# EAGLE design papillio-pmod-target (EAGLE 6.5.0)
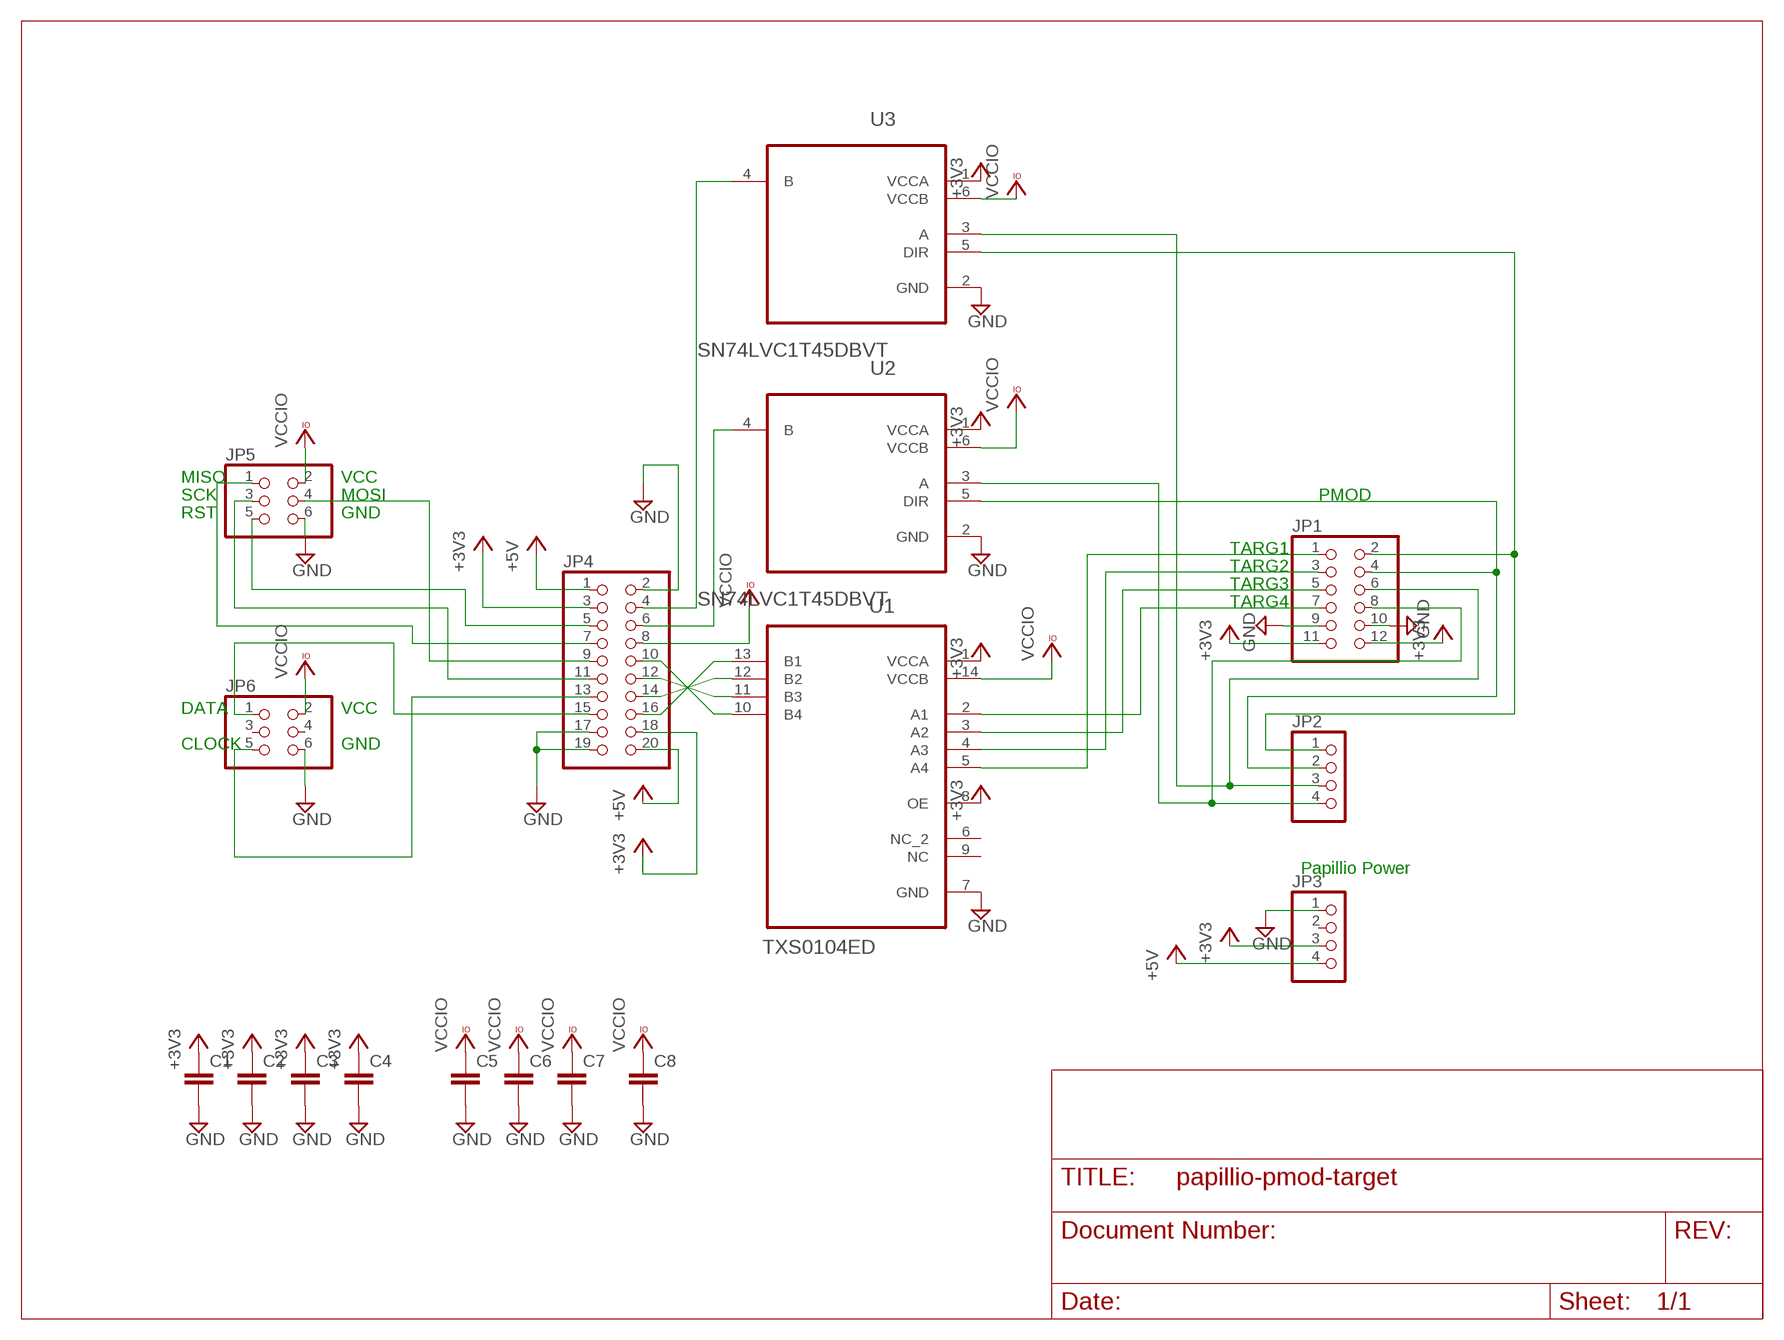
[diagram p0: schematic, sheet 1]

## Parts
C1  C-EUC0603  [C0603]
C2  C-EUC0603  [C0603]
C3  C-EUC0603  [C0603]
C4  C-EUC0603  [C0603]
C5  C-EUC0603  [C0603]
C6  C-EUC0603  [C0603]
C7  C-EUC0603  [C0603]
C8  C-EUC0603  [C0603]
JP1  PINHD-2X6  [2X06]
JP2  PINHD-1X4  [1X04]
JP3  PINHD-1X4  [1X04]
JP4  PINHD-2X10  [2X10]
JP5  PINHD-2X3  [2X03]
JP6  PINHD-2X3  [2X03]
U1  TXS0104ED  [SOIC127P600X175-14N]
U2  SN74LVC1T45DBVT  [SOT95P280X145-6N]
U3  SN74LVC1T45DBVT  [SOT95P280X145-6N]

## Nets
+3V3 [power]: C1.1 C2.1 C3.1 C4.1 JP1.11 JP1.12 JP3.3 JP4.3 JP4.18 U1.1(VCCA) U1.8(OE) U2.1(VCCA) U3.1(VCCA)
+5V [power]: JP3.4 JP4.1 JP4.20
GND [power]: C1.2 C2.2 C3.2 C4.2 C5.2 C6.2 C7.2 C8.2 JP1.9 JP1.10 JP3.1 JP4.2 JP4.17 JP4.19 JP5.6 JP6.6 U1.7(GND) U2.2(GND) U3.2(GND)
N$1: JP1.2 JP2.1
N$2: JP1.4 JP2.2 U2.5(DIR)
N$3: JP1.6 JP2.3 U3.3(A)
N$4: JP1.8 JP2.4 U2.3(A)
N$5: JP4.10 U1.10(B4)
N$6: JP4.16 U1.13(B1)
N$7: JP4.14 U1.12(B2)
N$8: JP4.12 U1.11(B3)
N$9: JP4.4 U3.4(B)
N$10: JP1.1 U1.5(A4)
N$11: JP1.3 U1.4(A3)
N$12: JP1.5 U1.3(A2)
N$13: JP1.7 U1.2(A1)
N$14: JP4.6 U2.4(B)
N$17: JP4.15 JP6.1
N$18: JP4.13 JP6.5
N$19: JP4.5 JP5.5
N$20: JP4.11 JP5.3
N$21: JP4.9 JP5.4
N$22: JP4.7 JP5.1
VCCIO [power]: C5.1 C6.1 C7.1 C8.1 JP4.8 JP5.2 JP6.2 U1.14(VCCB) U2.6(VCCB) U3.6(VCCB)
Unconnected: JP3.2 JP6.3 JP6.4 U1.6(NC_2) U1.9(NC) U3.5(DIR)

## Notes on the sheet
- MISO | VCC
- SCK | MOSI | PMOD
- RST | GND
- TARG1
- TARG2
- TARG3
- TARG4
- DATA | VCC
- CLOCK | GND
- Papillio Power

## Library data of the parts
C1-C8 = resistor:C-EU: CAPACITOR, European symbol
JP1 = pinhead:PINHD-2X6: PIN HEADER
JP2 JP3 = pinhead:PINHD-1X4: PIN HEADER
JP4 = pinhead:PINHD-2X10: PIN HEADER
JP5 JP6 = pinhead:PINHD-2X3: PIN HEADER
U1 = Texas Instruments_By_element14_Batch_1:TXS0104ED: 4-BIT BIDIRECTIONAL VOLTAGE-LEVEL TRANSLATOR FOR OPEN-DRAIN AND PUSH-PULL APPLICATIONS; MPN: TXS0104ED; OC_FARNELL: 1607892; OC_NEWARK: 10M0686; PACKAGE: SOIC-14; SUPPLIER: TEXAS INSTRUMENTS
U2 U3 = Texas Instruments_By_element14_Batch_1:SN74LVC1T45DBVT: BUS Transceiver; MPN: SN74LVC1T45DBVT; OC_FARNELL: 1470916; OC_NEWARK: 01J0796; PACKAGE: SOT-23; SUPPLIER: Texas Instruments

## Net classes
1 power: width 0.381 mm

## Board
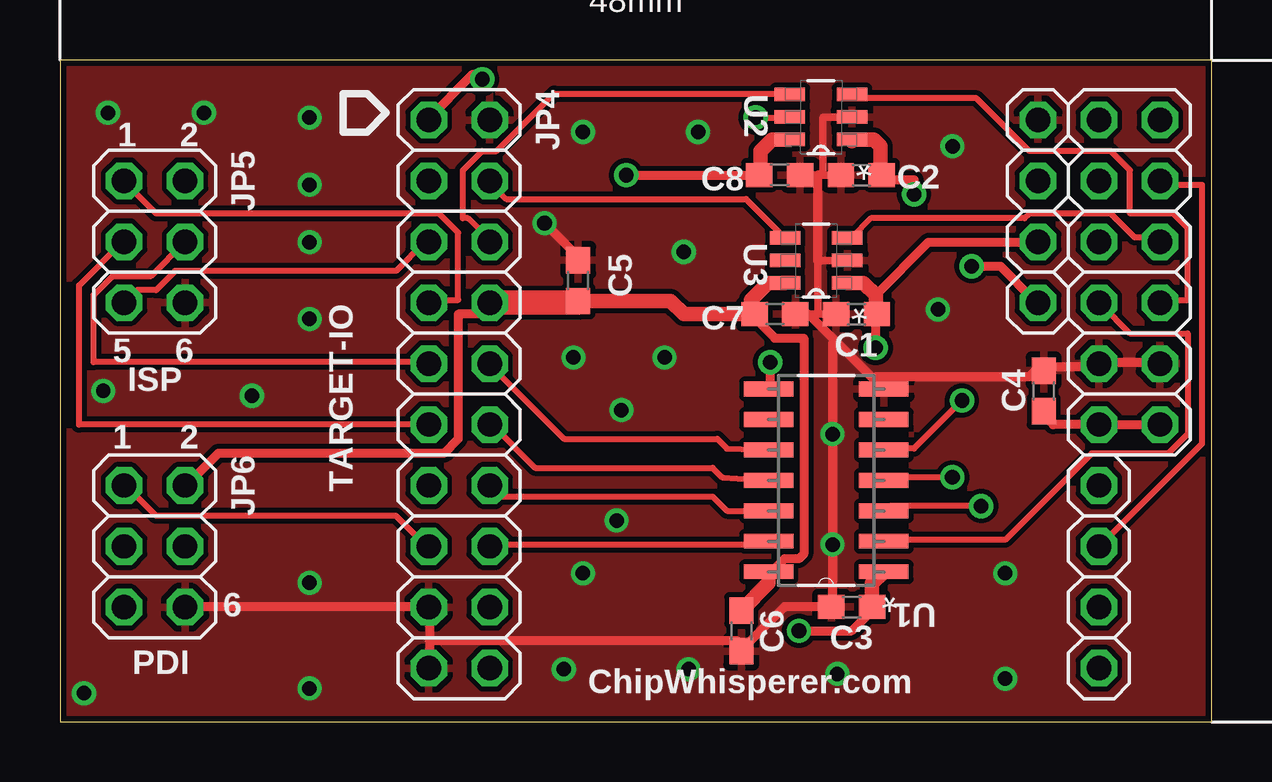
[diagram p1: board, top side]
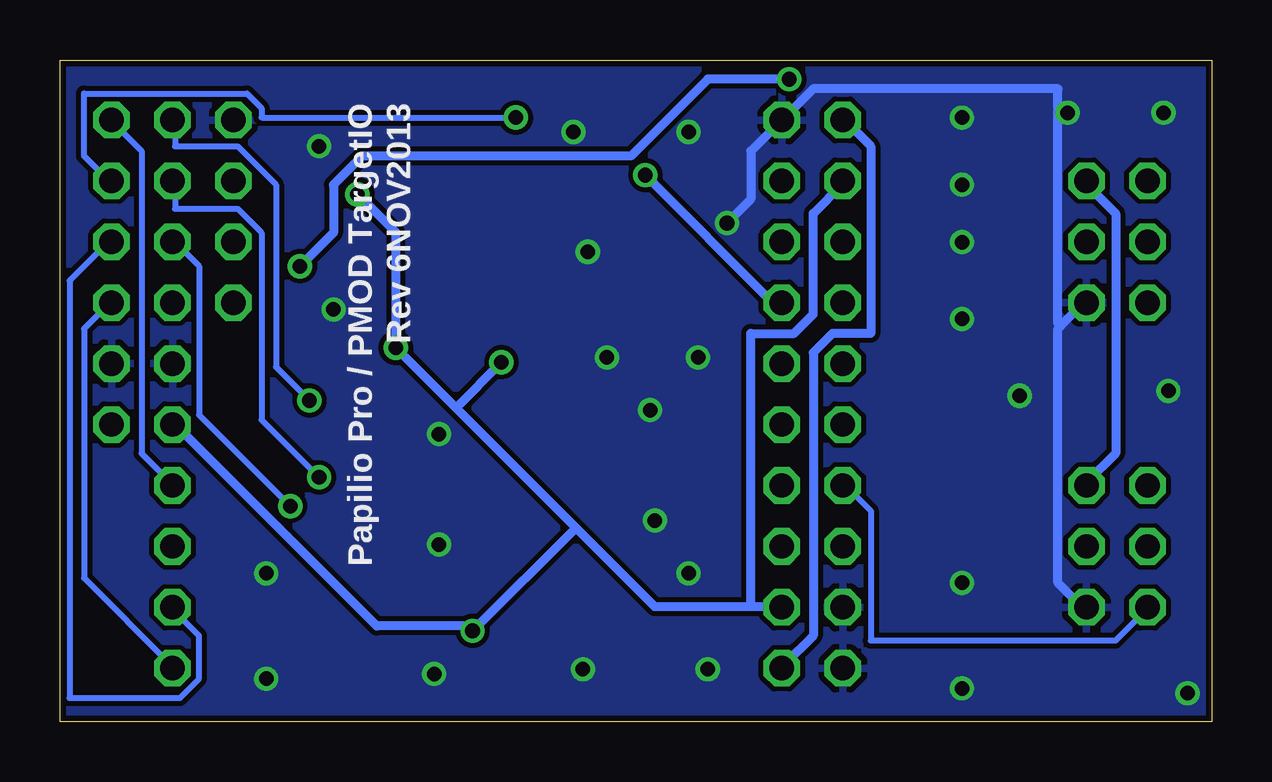
[diagram p2: board, bottom side, seen from below]

Size 48 x 27.6 mm. Coordinates in mm from the lower left corner, seen from the top.
Outline: 0,0 48,0 48,27.6 0,27.6 0,0
Copper layers (1*16): Top 0.035mm / dielectric 1.5mm / Bottom 0.035mm
Design rules "default *": minimum track width 10mil, minimum drill 24mil, track to track 8mil, track to pad 8mil, pad to pad 8mil, via to via 8mil, smd to smd 8mil, copper to edge 10mil, drill to drill 8mil, minimum pad ring 10mil, minimum via ring 8mil, stop-mask expansion 4mil, vias tented up to drill 25mil, thermal gap 10mil

### Footprints (pad centres in the part's own frame; a part is rotated, then mirrored left to right if it is on the bottom)
C0603 = smd 1.1 x 1: 1 -0.85,0; 2 0.85,0
2X06 = drill 1.016 octagon: 1 -6.35,-1.27; 2 -6.35,1.27; 3 -3.81,-1.27; 4 -3.81,1.27; 5 -1.27,-1.27; 6 -1.27,1.27; 7 1.27,-1.27; 8 1.27,1.27; 9 3.81,-1.27; 10 3.81,1.27; 11 6.35,-1.27; 12 6.35,1.27
1X04 = drill 1.016 octagon: 1 -3.81,0; 2 -1.27,0; 3 1.27,0; 4 3.81,0
2X10 = drill 1.016 octagon: 1 -11.43,-1.27; 2 -11.43,1.27; 3 -8.89,-1.27; 4 -8.89,1.27; 5 -6.35,-1.27; 6 -6.35,1.27; 7 -3.81,-1.27; 8 -3.81,1.27; 9 -1.27,-1.27; 10 -1.27,1.27; 11 1.27,-1.27; 12 1.27,1.27; 13 3.81,-1.27; 14 3.81,1.27; 15 6.35,-1.27; 16 6.35,1.27; 17 8.89,-1.27; 18 8.89,1.27; 19 11.43,-1.27; 20 11.43,1.27
2X03 = drill 1.016 octagon: 1 -2.54,-1.27; 2 -2.54,1.27; 3 0,-1.27; 4 0,1.27; 5 2.54,-1.27; 6 2.54,1.27
SOIC127P600X175-14N = smd 2.057 x 0.61: 1 -4.801,7.62; 2 -4.801,6.35; 3 -4.801,5.08; 4 -4.801,3.81; 5 -4.801,2.54; 6 -4.801,1.27; 7 -4.801,0; 8 0,0; 9 0,1.27; 10 0,2.54; 11 0,3.81; 12 0,5.08; 13 0,6.35; 14 0,7.62
SOT95P280X145-6N = smd 1.27 x 0.559: 1 -1.295,0.94; 2 -1.295,0; 3 -1.295,-0.94; 4 1.295,-0.94; 5 1.295,0; 6 1.295,0.94

### Placement (x,y rotation side)
C1  33.2,17 180 top
C2  33.4,22.8 180 top
C3  33,4.8 180 top
C4  41,13.8 90 top
C5  21.6,18.4 90 top
C6  28.4,3.8 270 top
C7  29.8,17 0 top
C8  30,22.8 0 top
JP1  44.58,18.75 270 top
JP2  43.31,6.05 270 top
JP3  40.77,21.29 270 top
JP4  16.64,13.67 270 top
JP5  3.94,20.02 270 top
JP6  3.94,7.32 270 top
U1  29.54,13.88 180 top
U2  31.72,25.22 180 top
U3  31.52,19.24 180 top

### Tracks (layer width: path | path; a pad name or v marks a point on that pad's centre or on a via)
+3V3  (via drill 0.61)
  Top 0.381: C2.1 34.4,22.6 35.6,22.6 v35.6,22 | C4.1 41,12.8 41.4,12.4 JP1.11 JP1.12 | v34,15.6 34,16.8 C1.1 | v29.6,15 29.6,14 U1.8 | v30.8,3.8 33,3.8 33.8,4.6 C3.1 | 34,17.8 36.2,20 40.6,20 JP3.3
  Top 0.61: C3.1 33.85,5.77 U1.1 | U3.1 33.5,18.3 34,17.8 34,17.05 C1.1 | 33.02,24.22 U2.1 33.92,24.28 34.2,24 34.2,22.85 C2.1
  Bottom 0.381: 26.5,8.1 23.2,4.8 19.2,4.8 | 26.5,8.1 31.5,13.1 | 31.5,13.1 v34,15.6 34,20.4 v35.6,22 | 19.2,4.8 18,4.8 JP4.18 | 31.5,13.1 v29.6,15 | 26.5,8.1 v30.8,3.8 30.8,4 34.8,4 43.2,12.4 JP1.11 | 19.2,4.8 19.2,16.2 17.4,16.2 16.6,17 16.6,21.2 15.4,22.4 JP4.3
+5V  (via drill 0.61)
  Top 0.381: 17.1,26.9 15.4,25.2 JP4.1 | 17.1,26.9 17.2,27 | v38,19 39.2,19 40.6,17.6 JP3.4 | v17.6,26.8 17.2,26.8 17.1,26.9
  Bottom 0.381: JP4.20 17.8,2.4 16.6,3.6 16.6,15.4 15.8,16.2 14.2,16.2 14.2,24 15.2,25 JP4.1 | v38,19 36.6,20.4 36.6,22.4 35.4,23.6 24.2,23.6 21,26.8 v17.6,26.8
GND  (via drill 0.6, 0.61)
  Top 0.305: U2.2 31.82,25.22 31.8,25.2 31.8,22.8 | 31.8,22.8 31.6,22.8 C8.2 | C2.2 31.8,22.8 | U3.2 31.64,19.24 31.6,19.2 31.6,17 | 31.6,17 31.2,17 C7.2 | C1.2 31.6,17
  Top 0.381: 41,14.8 43.2,14.8 JP1.9 43.4,15 45.8,15 JP1.10 | 41,14.8 40.8,14.8 | 41,14.8 C4.2 40.8,14.8 | 31.2,17 32.3,15.9 | 32.3,15.9 33.9,14.3 | 33.9,14.3 34.2,14 U1.7 | 31.6,19.2 31.6,22.8 | 32.3,15.9 32.2,15.8 32.2,4.8 C3.2 30.2,4.8 28.4,3 C6.2 28.4,3.2 28.2,3.4 15.4,3.4 | 40.8,14.8 40.4,14.4 34,14.4 33.9,14.3 | v20.2,20.8 21.6,19.4 C5.2 | JP6.6 5.4,4.8 15.2,4.8 JP4.17 15.4,4.6 15.4,3.4 | 15.4,3.4 15.4,2.4 JP4.19
  Bottom 0.381: v20.2,20.8 19.2,21.8 19.2,23.8 18,25 JP4.2 17.8,25.2 16.6,26.4 6.4,26.4 6.4,16.6 6.3,16.5 | 6.3,16.5 6.4,16.4 6.4,5.8 5.4,4.8 JP6.6 | 6.3,16.5 5.4,17.4 JP5.6
  other vias: 21.8,24.6 26.6,24.6 26,19.6 21.4,15.2 25.2,15.2 23.4,13 21.8,6.2 21,2.2 26.2,2.2 32.4,2 32.2,12 32.2,7.4 39.4,1.8 39.4,6.2 36.6,17.2 37.2,24 10.4,25.2 10.4,22.4 10.4,16.8 10.4,5.8 10.4,1.4 1,1.2 1.8,13.8 8,13.6 2,25.4 6,25.4 23.2,8.4 10.4,20
  pour Top: -1.8,29.4 -1.8,-1.6 51.8,-1.6 51.8,29.4
  pour Bottom: -3.4,31.4 -3.4,-2.4 55.8,-2.4 55.8,31.2 -3.2,31.2
N$1
  Bottom 0.254: JP2.1 43.4,10 44.6,11.2 44.6,23.8 45.8,25 JP1.2
N$2  (via drill 0.61)
  Top 0.254: v29,25.2 30.4,25.2 U2.5 | JP2.2 43.4,7.4 47.6,11.6 47.6,22.4 46,22.4 JP1.4
  Bottom 0.254: v29,25.2 39.6,25.2 39.6,25.6 40.2,26.2 47,26.2 47,23.6 46,22.6 JP1.4
N$3
  Top 0.254: U3.3 33,20.2 33.8,21 40.2,21 40.4,21.2 43.8,21.2 44.8,20.2 45.8,20.2 JP1.6
  Bottom 0.254: JP2.3 43.2,4.6 42.2,3.6 42.2,1.8 43,1 47.6,1 47.6,18.4 46,20 JP1.6
N$4
  Top 0.254: U2.3 33.2,26 38.2,26 40.4,23.8 43.8,23.8 44.6,23 44.6,21.2 46.4,21.2 47,20.6 47,17.6 46,17.6 JP1.8
  Bottom 0.254: JP2.4 43.4,2.4 47,6 47,16.4 46,17.4 JP1.8
N$5
  Top 0.254: U1.10 27.8,11.4 27.4,11.8 21,11.8 18,14.8 JP4.10
N$6
  Top 0.254: U1.13 29.4,7.4 18,7.4 JP4.16
N$7
  Top 0.254: U1.12 27.8,8.8 27.2,9.4 18.4,9.4 18,9.8 JP4.14
N$8
  Top 0.254: U1.11 27.6,10.2 27.2,10.6 19.8,10.6 18,12.4 JP4.12
N$9
  Top 0.254: U3.4 30.2,20.2 28.6,21.8 18.6,21.8 18,22.4 JP4.4
N$10  (via drill 0.61)
  Top 0.254: v37.6,13.4 35.6,11.4 34.4,11.4 U1.5
  Bottom 0.254: v37.6,13.4 39,14.8 39,22.4 40.6,24 43.2,24 43.2,25 JP1.1
N$11  (via drill 0.61)
  Top 0.254: v37.2,10.2 34.4,10.2 U1.4
  Bottom 0.254: v37.2,10.2 39.6,12.6 39.6,20.4 40.6,21.4 43.2,21.4 43.2,22.4 JP1.3
N$12  (via drill 0.61)
  Top 0.254: v38.4,9 34.6,9 34.4,8.8 U1.3
  Bottom 0.254: v38.4,9 42.2,12.8 42.2,19 43.2,20 JP1.5
N$13
  Top 0.254: 34.2,7.6 34.6,7.6 | 34.6,7.6 39.4,7.6 43,11.2 46.2,11.2 47,12 47,16.2 44.6,16.2 43.4,17.4 JP1.7 | 34.6,7.6 U1.2
N$14
  Top 0.254: U2.4 30.4,26.2 20.6,26.2 18.2,23.8 17.6,23.8 16.8,23 16.8,21 17,21 17.8,20.2 JP4.6
N$17
  Top 0.254: JP6.1 2.8,9.8 4,8.6 14,8.6 15.2,7.4 JP4.15
N$18
  Bottom 0.254: JP6.5 2.8,4.6 4,3.4 14.2,3.4 14.2,8.8 15.2,9.8 JP4.13
N$19
  Top 0.254: JP5.5 2.8,17.6 3.2,18 4,18 4.8,18.8 14,18.8 15.2,20 JP4.5
N$20
  Top 0.254: JP4.11 0.8,12.4 0.8,18.2 2.6,20 JP5.3
N$21
  Top 0.254: JP5.4 5.2,20 3.8,18.6 2.2,18.6 1.4,17.8 1.4,15 15.2,15 JP4.9
N$22
  Top 0.254: JP5.1 2.8,22.4 4,21.2 15.8,21.2 16.6,20.4 16.6,17.6 15.4,17.6 JP4.7
VCCIO  (via drill 0.61)
  Top 0.381: v23.6,22.8 C8.1 | U1.14 29.8,6.4 30.2,6.8 30.8,6.8 31,7 31,16 29.8,16 29,16.8 C7.1 | JP6.2 5.4,10 6.6,11.2 16,11.2 16.6,11.8 16.6,17 17.8,17 JP4.8
  Top 0.61: C5.1 25.45,17.55 26,17 C7.1 28.8,17.15 28.8,17.6 29.5,18.3 U3.6 | U1.14 29.54,5.79 C6.1 | U2.6 29.68,24.28 29.2,23.8 29.2,22.85 C8.1
  Top 1.016: JP4.8 21.6,17.48 C5.1
  Bottom 0.381: JP6.2 5.2,10 4,11.2 4,21.2 5.2,22.4 JP5.2 | v23.6,22.8 18.4,17.6 18,17.6 JP4.8

### Text on the board
tPlace: 1 | 2 | 5 | 6 | ISP | 1 | 2 | TARGET-IO | 6 | PDI | ChipWhisperer.com
bPlace: Rev 6NOV2013 | Papilio Pro / PMOD TargetIO